# Altium schematic sheet Sheet1 (1).SchDoc
size A4; SheetNumber: 1; SheetTotal: 1
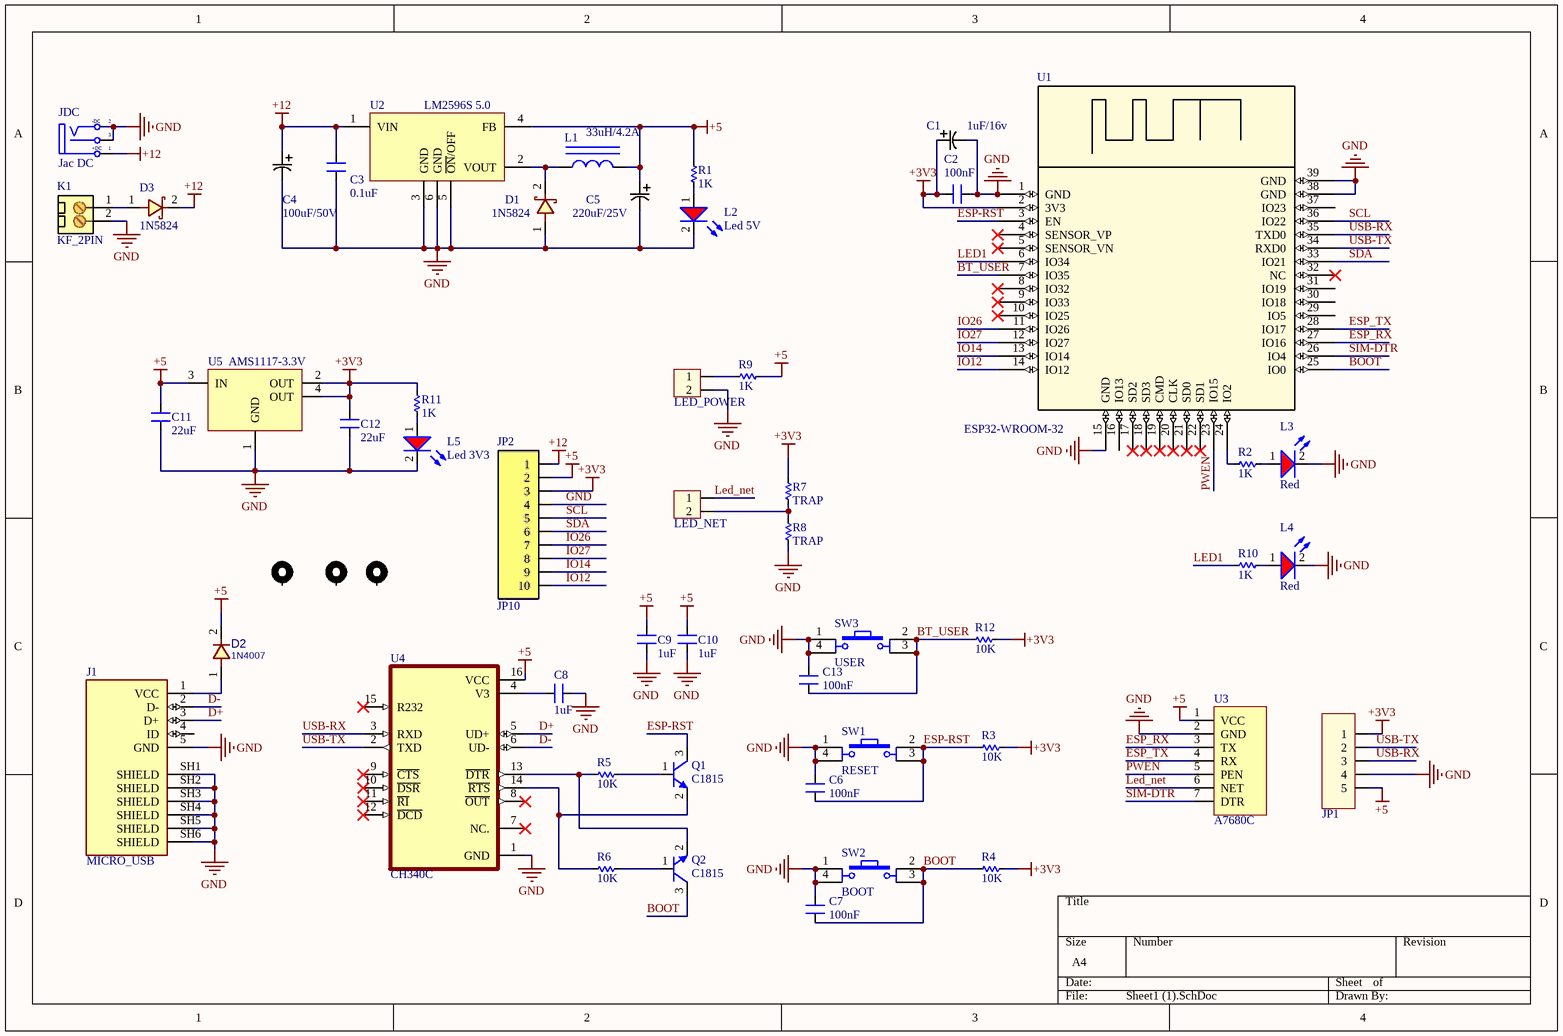
[diagram p0: Sheet1 (1).SchDoc]

## Parts
C1  1uF/16v  [CAP-TANTALUM-1206 - ( 3216 )]
C2  100nF  [CAP-0603]
C3  0.1uF  [CAP-0603]
C4  100uF/50V  [C8mm-p3]
C5  220uF/25V  [C8mm-p3]
C6  100nF  [CAP-0603]
C7  100nF  [CAP-0603]
C8  1uF  [CAP-0603]
C9  1uF  [CAP-0603]
C10  1uF  [CAP-0603]
C11  22uF  [Cap-0805]
C12  22uF  [Cap-0805]
C13  100nF  [CAP-0603]
D1  1N5824  [DO-214AC_SS34]
D2  1N4007  [SOD-123]
D3  1N5824  [DO-214AC_SS34]
J1  MICRO_USB  [MICRO_USB]
JDC  Jac DC  [DC-IN_5.5x2.5]
JP1  Connector  [jp5]  (value not drawn)
JP2  JP10  [JP_10PIN]
K1  KF_2PIN  [KF_2PIN]
L1  33uH/4.2A  [INDC_L127H_331]
L2  value Led 5V  [LED_0805_smd]  (hidden comment: LED)
L3  value Red  [LED_0805_smd]  (hidden comment: LED)
L4  value Red  [LED_0805_smd]  (hidden comment: LED)
L5  value Led 3V3  [LED_0805_smd]  (hidden comment: LED)
LED_NET  BUS_2PIN  [CON2]  (value not drawn)
LED_POWER  BUS_2PIN  [CON2]  (value not drawn)
Q1  C1815  [SOT-23]
Q2  C1815  [SOT-23]
R1  1K  [RES-0603]
R2  1K  [RES-0603]
R3  10K  [RES-0603]
R4  10K  [RES-0603]
R5  10K  [RES-0603]
R6  10K  [RES-0603]
R7  TRAP  [RES-0603]
R8  TRAP  [RES-0603]
R9  1K  [RES-0603]
R10  1K  [RES-0603]
R11  1K  [RES-0603]
R12  10K  [RES-0603]
SW1  RESET  [SW4-SMD-6mm]
SW2  BOOT  [SW4-SMD-6mm]
SW3  USER  [SW4-SMD-6mm]
U1  ESP32-WROOM-32  [ESP32-WROOM-32D]
U2  LM2596S 5.0  [TO263-5]
U3  A7680C  [TDM-SIM7680C-POWER_LOGIC]
U4  CH340C  [SOP-16]
U5  AMS1117-3.3V  [SOT223-4M]
V1  VIA  [VIA]  (value not drawn)
V2  VIA  [VIA]  (value not drawn)
V3  VIA  [VIA]  (value not drawn)

## Nets
+3V3: C1.1 C2.1 C12.1 JP1.1 JP2.3 R3.2 R4.2 R7.2 R11.1 R12.2 U1.2(3V3) U5.2(OUT) U5.4(OUT)
+5: C5.1 C9.2 C10.2 C11.1 D2.2 JP1.5 JP2.2 L1.2 R1.1 R9.1 U2.4(FB) U3.1(VCC) U4.16(VCC) U5.3(IN)
+12: C3.2 C4.1 D3.2 JDC.1(T) JP2.1 U2.1(VIN)
GND: C1.2 C2.2 C3.1 C4.2 C5.2 C6.1 C7.1 C8.2 C9.1 C10.1 C11.2 C12.2 C13.1 D1.1 J1.5(GND) J1.SH1(SHIELD) J1.SH2(SHIELD) J1.SH3(SHIELD) J1.SH4(SHIELD) J1.SH5(SHIELD) J1.SH6(SHIELD) JDC.2(TN) JDC.3(S) JP1.4 JP2.4 K1.2 L2.2(K) L3.2(K) L4.2(K) L5.2(K) LED_POWER.2 R8.1 SW1.1 SW1.4 SW2.1 SW2.4 SW3.1 SW3.4 U1.1(GND) U1.15(GND) U1.38(GND) U1.39(GND) U2.3(GND) U2.5(~{ON}/OFF) U2.6(GND) U3.2(GND) U4.1(GND) U5.1(GND)
BOOT: C7.2 Q2.3(C) R4.1 SW2.2 SW2.3 U1.25(IO0)
BT_USER: C13.2 R12.1 SW3.2 SW3.3 U1.7(IO35)
D+: J1.3(D+) U4.5(UD+)
D-: J1.2(D-) U4.6(UD-)
ESP-RST: C6.2 Q1.3(C) R3.1 SW1.2 SW1.3 U1.3(EN)
ESP_RX: U1.27(IO16) U3.3(TX)
ESP_TX: U1.28(IO17) U3.4(RX)
IO12: JP2.10 U1.14(IO12)
IO14: JP2.9 U1.13(IO14)
IO26: JP2.7 U1.11(IO26)
IO27: JP2.8 U1.12(IO27)
LED1: R10.1 U1.6(IO34)
Led_net: LED_NET.1 U3.6(NET)
PWEN: U1.23(IO15) U3.5(PEN)
SCL: JP2.5 U1.36(IO22)
SDA: JP2.6 U1.33(IO21)
SIM-DTR: U1.26(IO4) U3.7(DTR)
USB-RX: JP1.3 U1.35(TXD0) U4.3(RXD)
USB-TX: JP1.2 U1.34(RXD0) U4.2(TXD)
NetC8_1: C8.1 U4.4(V3)
NetD1_2: D1.2 L1.1 U2.2(VOUT)
NetD2_1: D2.1 J1.1(VCC)
NetD3_1: D3.1 K1.1
NetL2_1: L2.1(A) R1.2
NetL3_1: L3.1(A) R2.2
NetL4_1: L4.1(A) R10.2
NetL5_1: L5.1(A) R11.2
NetLED_NET_2: LED_NET.2 R7.1 R8.2
NetLED_POWER_1: LED_POWER.1 R9.2
NetQ1_1: Q1.1(B) R5.2
NetQ1_2: Q1.2(E) R6.1 U4.14(~{RTS})
NetQ2_1: Q2.1(B) R6.2
NetQ2_2: Q2.2(E) R5.1 U4.13(~{DTR})
NetR2_1: R2.1 U1.24(IO2)

Not connected (* = marked no-connect by the designer): J1 4(ID); U1 4(SENSOR_VP)* 5(SENSOR_VN)* 8(IO32)* 9(IO33)* 10(IO25)* 16(IO13) 17(SD2)* 18(SD3)* 19(CMD)* 20(CLK)* 21(SD0)* 22(SD1)* 29(IO5) 30(IO18) 31(IO19) 32(NC)* 37(IO23); U4 7(NC.)* 8(~{OUT})* 9(~{CTS})* 10(~{DSR})* 11(~{RI})* 12(~{DCD})* 15(R232)*; V1 1; V2 1; V3 1

## Notes on the sheet
- (in symbol DCIN-DC5525) -DC; +DC

## Library data of the parts
C1 C4 = CAP_PHANCUCDEN
C2 C3 C6-C13 = CAP ko phan cuc: Cap np W0.3; Value: 0,047uF; Copyright: VanDungEvn
C5 = CAP_ALU
D1 D3 = 1N5822
D2 = DIODE: DIODE, GENERAL PURPOSE, 1000V/1A; MANF: Diodes; DESC: DESCRIPTION; PARAM: 1000V, 1.15V; PARAM2: 1.5A; ASSEMBLY: ASSEMBLY; PRICE: PRICE; MANF_P#: 1N4007; VALUE: 1N4007
J1 = MICRO_USB: Micro USB, Input Output Connectors, B TYPE RECEPTACLE with flange; MF: Amphenol ICC; MP: 10118194-0001LF; SnapEDA_Link: https://www.snapeda.com/parts/10118194-0001LF/Amphenol+FCI/view-part/?ref=snap; Package: None; Value: *; Check_prices: https://www.snapeda.com/parts/10118194-0001LF/Amphenol+FCI/view-part/?ref=eda
JDC = DCIN-DC5525: Jac DC input; Value: Jac DC
JP1 = JP5
JP2 = XH2.54_10P: Connector 10; Value: Connector 10
L1 = inductor
L2-L5 = LED_RED_SMD: LED Red 3mm/5MM; ComponentLink1Description: Datasheet; ComponentLink1URL: D:\Dropbox\Datasheets\Opto and Illumination\LEDs\SMD LED.pdf; Unit Price: 0.0476
LED_NET LED_POWER = CON2: Connector 2; Value: Connector 2
Q1 Q2 = C1815-SMD: Trans NPN 50V 150mA TO-92; ComponentLink1Description: Datasheet; ComponentLink1URL: D:\Dropbox\Datasheets\Transistors\P Channel Bipolar\2SC1815.pdf; Unit Price: 0.0143
R1-R12 = Res: Manufacturer: Generic Components; Class: Passive; SubClass: R; Published: 08/06/2000; Publisher: Altium Hobart Technology Centre
SW1-SW3 = Button
U2 = LM2596: 1A Regulator
U3 = SIMCOM_A7680C_MODULE
U5 = AMS1117